# EAGLE design shield Arduino (EAGLE 6.1)
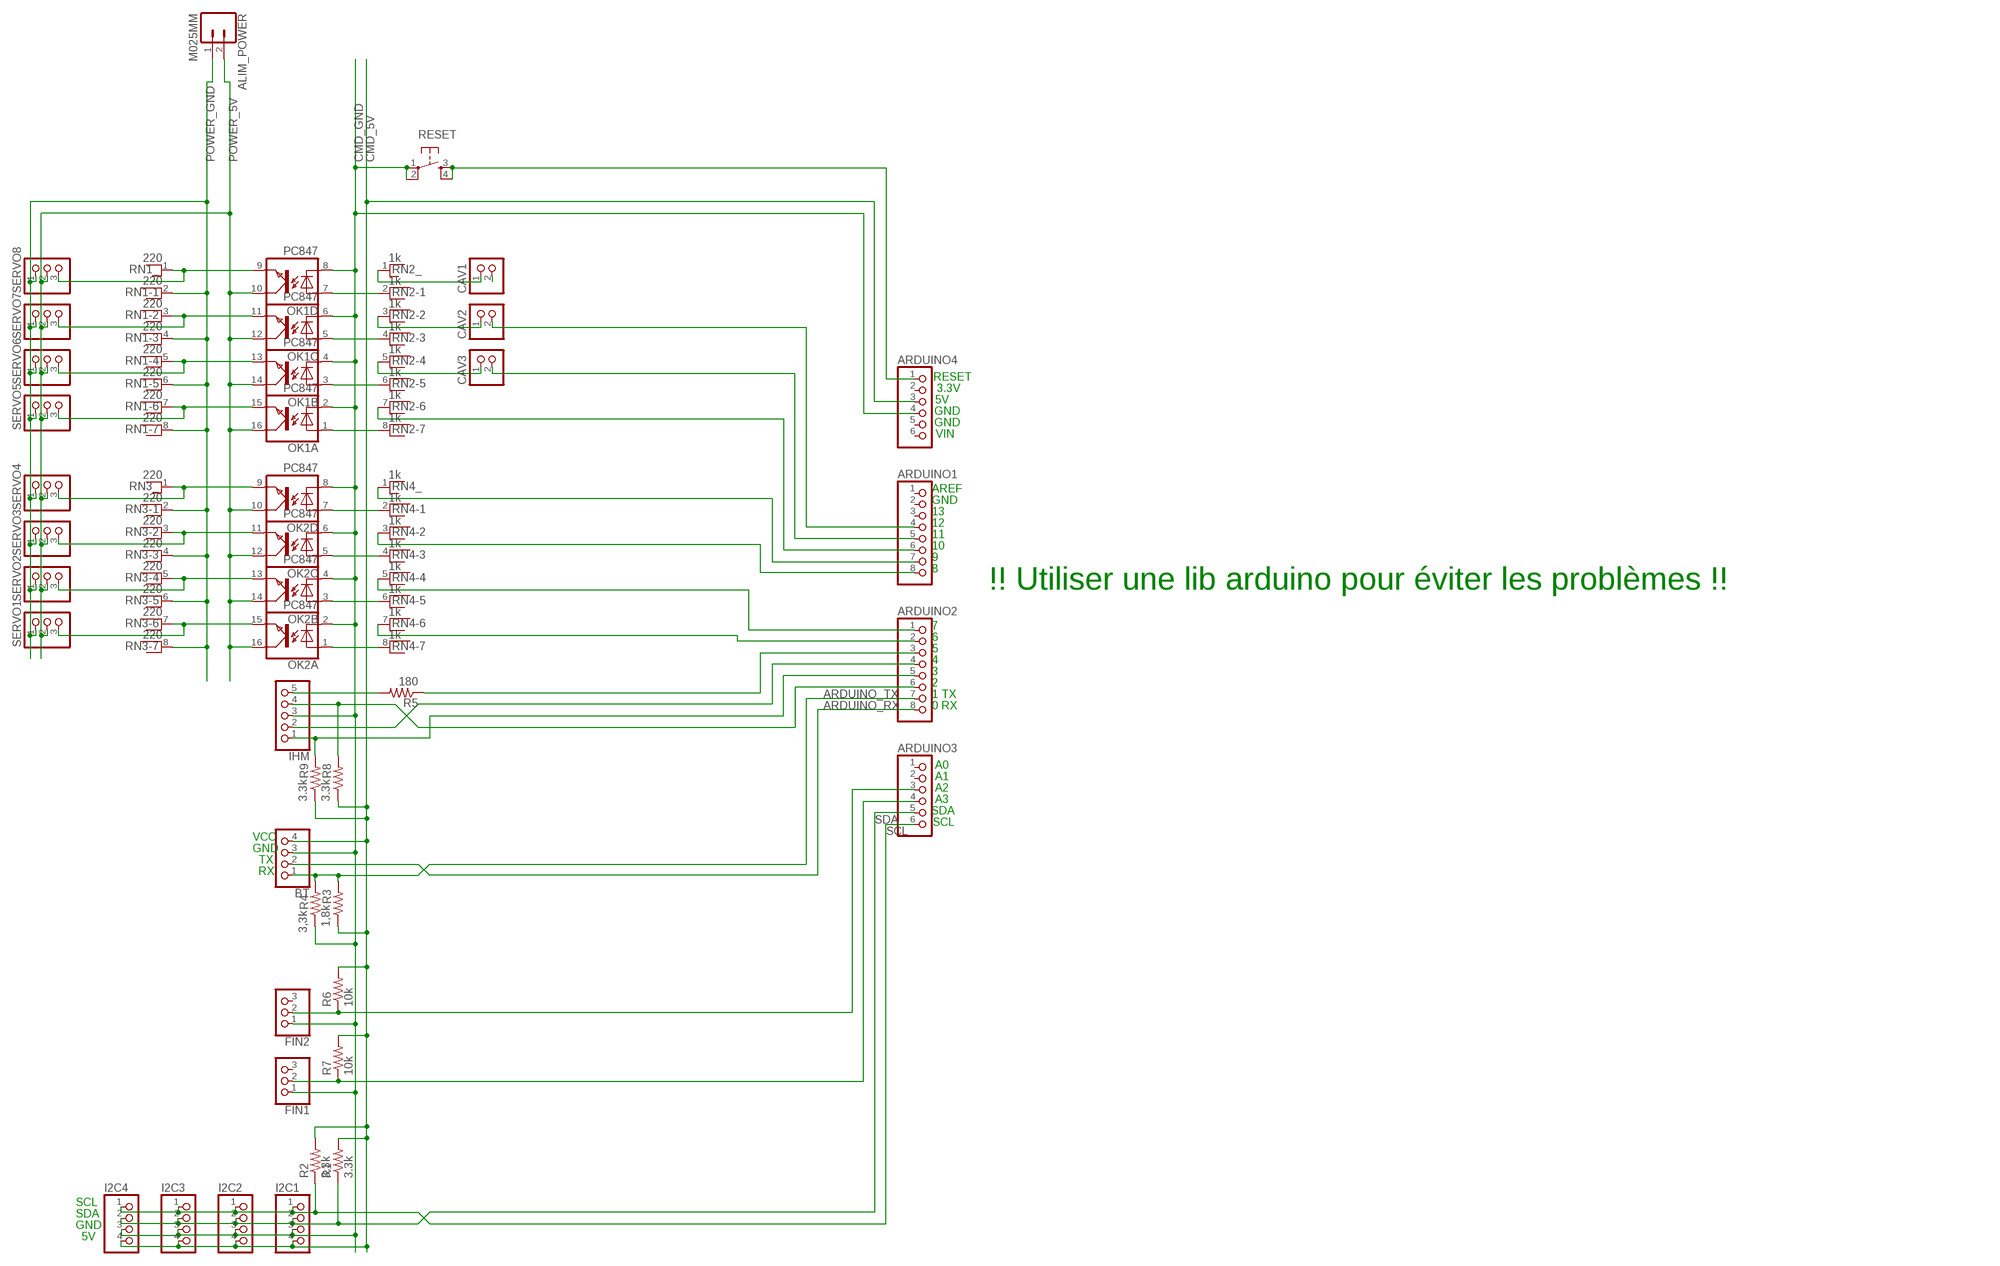
[diagram p0: schematic, sheet 1]

## Parts
ALIM_POWER  M025MM  [SCREWTERMINAL-5MM-2]
ARDUINO1  PINHD-1X8  [1X08]
ARDUINO2  PINHD-1X8  [1X08]
ARDUINO3  PINHD-1X6  [1X06]
ARDUINO4  PINHD-1X6  [1X06]
BT  PINHD-1X4  [1X04]
CAV1  PINHD-1X2  [1X02]
CAV2  PINHD-1X2  [1X02]
CAV3  PINHD-1X2  [1X02]
FIN1  PINHD-1X3  [1X03]
FIN2  PINHD-1X3  [1X03]
I2C1  PINHD-1X4  [1X04]
I2C2  PINHD-1X4  [1X04]
I2C3  PINHD-1X4  [1X04]
I2C4  PINHD-1X4  [1X04]
IHM  PINHD-1X5  [1X05]
OK1  PC847  [DIL16]
OK2  PC847  [DIL16]
R1  3.3k  R-US_0204/7  [0204/7]
R2  3.3k  R-US_0204/7  [0204/7]
R3  1,8k  R-US_0204/7  [0204/7]
R4  3,3k  R-US_0204/7  [0204/7]
R5  180  R-US_0204/7  [0204/7]
R6  10k  R-US_0204/7  [0204/7]
R7  10k  R-US_0204/7  [0204/7]
R8  3.3k  R-US_0204/7  [0204/7]
R9  3.3k  R-US_0204/7  [0204/7]
RESET  TAC_SWITCHPTH  [TACTILE-PTH]
RN1  220  RNX7  [RN-8]
RN2  1k  RNX7  [RN-8]
RN3  220  RNX7  [RN-8]
RN4  1k  RNX7  [RN-8]
SERVO1  PINHD-1X3  [1X03]
SERVO2  PINHD-1X3  [1X03]
SERVO3  PINHD-1X3  [1X03]
SERVO4  PINHD-1X3  [1X03]
SERVO5  PINHD-1X3  [1X03]
SERVO6  PINHD-1X3  [1X03]
SERVO7  PINHD-1X3  [1X03]
SERVO8  PINHD-1X3  [1X03]

## Nets
ARDUINO_RX: ARDUINO2.8 BT.2
ARDUINO_TX: ARDUINO2.7 BT.1 R3.2 R4.2
CMD_5V: ARDUINO4.3 BT.4 I2C1.4 I2C2.4 I2C3.4 I2C4.4 R1.2 R2.2 R3.1 R6.2 R7.2 R8.1 R9.1
CMD_GND: ARDUINO4.4 BT.3 FIN1.1 FIN2.1 I2C1.3 I2C2.3 I2C3.3 I2C4.3 IHM.3 OK1.2(A:C) OK1.4(B:C) OK1.6(C:C) OK1.8(D:C) OK2.2(A:C) OK2.4(B:C) OK2.6(C:C) OK2.8(D:C) R4.1 RESET.1 RESET.2
N$1: CAV1.2
N$2: OK2.7(D:A) RN4.2
N$3: ARDUINO1.4 CAV2.2
N$4: OK2.5(C:A) RN4.4
N$5: OK2.3(B:A) RN4.6
N$6: OK1.15(A:EMIT) RN1.7 SERVO5.3
N$7: OK1.9(D:EMIT) RN1.1 SERVO8.3
N$8: ARDUINO1.5 CAV3.2
N$9: OK2.1(A:A) RN4.8
N$10: OK1.11(C:EMIT) RN1.3 SERVO7.3
N$11: OK1.13(B:EMIT) RN1.5 SERVO6.3
N$12: OK1.1(A:A) RN2.8
N$13: OK1.3(B:A) RN2.6
N$14: OK1.5(C:A) RN2.4
N$15: OK1.7(D:A) RN2.2
N$16: CAV1.1 RN2.1
N$17: CAV2.1 RN2.3
N$18: CAV3.1 RN2.5
N$19: ARDUINO1.6 RN2.7
N$20: OK2.15(A:EMIT) RN3.7 SERVO1.3
N$21: OK2.9(D:EMIT) RN3.1 SERVO4.3
N$22: OK2.11(C:EMIT) RN3.3 SERVO3.3
N$23: OK2.13(B:EMIT) RN3.5 SERVO2.3
N$24: ARDUINO4.1 RESET.3 RESET.4
N$28: ARDUINO1.7 RN4.1
N$29: ARDUINO1.8 RN4.3
N$30: ARDUINO2.1 RN4.5
N$31: ARDUINO2.2 RN4.7
N$33: IHM.5 R5.2
N$34: ARDUINO3.4 FIN1.2 R7.1
N$35: ARDUINO3.3 FIN2.2 R6.1
N$36: ARDUINO2.3 R5.1
N$37: ARDUINO2.5 IHM.1 R9.2
N$38: ARDUINO2.4 IHM.2
N$39: ARDUINO2.6 IHM.4 R8.2
POWER_5V: ALIM_POWER.2 OK1.10(D:COL) OK1.12(C:COL) OK1.14(B:COL) OK1.16(A:COL) OK2.10(D:COL) OK2.12(C:COL) OK2.14(B:COL) OK2.16(A:COL) SERVO1.2 SERVO2.2 SERVO3.2 SERVO4.2 SERVO5.2 SERVO6.2 SERVO7.2 SERVO8.2
POWER_GND: ALIM_POWER.1 RN1.2 RN1.4 RN1.6 RN1.8 RN3.2 RN3.4 RN3.6 RN3.8 SERVO1.1 SERVO2.1 SERVO3.1 SERVO4.1 SERVO5.1 SERVO6.1 SERVO7.1 SERVO8.1
SCL: ARDUINO3.6 I2C1.1 I2C2.1 I2C3.1 I2C4.1 R2.1
SDA: ARDUINO3.5 I2C1.2 I2C2.2 I2C3.2 I2C4.2 R1.1
Unconnected: ARDUINO1.1 ARDUINO1.2 ARDUINO1.3 ARDUINO3.1 ARDUINO3.2 ARDUINO4.2 ARDUINO4.5 ARDUINO4.6 FIN1.3 FIN2.3

## Notes on the sheet
- RESET
- 3.3V
- 5V
- GND
- GND
- VIN
- AREF
- GND
- 13
- 12
- 11
- 10
- 9
- 8
- !! Utiliser une lib arduino pour éviter les problèmes !!
- 7
- 6
- 5
- 4
- 3
- 2
- 1 TX
- 0 RX
- A0
- A1
- A2
- A3
- SDA
- SCL
- VCC
- GND
- TX
- RX
- SCL
- SDA
- GND
- 5V

## Library data of the parts
ALIM_POWER = SparkFun-Connectors:M02: Standard 2-pin 0.1" header. Use with - straight break away headers ( PRT-00116) - right angle break away headers (PRT-00553) - swiss pins (PRT-00743) - machine pins (PRT-00117) - female headers (PRT-00115) Molex polarized connector foot print use with: PRT-08233 with associated crimp pins and housings. 2.54_SCREWTERM for use with PRT-10571. 3.5mm Screw Terminal footprints for PRT-08084 5mm Screw Terminal footprints for use with PRT-08433
ARDUINO1 ARDUINO2 = pinhead:PINHD-1X8: PIN HEADER
ARDUINO3 ARDUINO4 = pinhead:PINHD-1X6: PIN HEADER
BT I2C1-I2C4 = pinhead:PINHD-1X4: PIN HEADER
CAV1-CAV3 = pinhead:PINHD-1X2: PIN HEADER
FIN1 FIN2 SERVO1-SERVO8 = pinhead:PINHD-1X3: PIN HEADER
IHM = pinhead:PINHD-1X5: PIN HEADER
OK1 OK2 = optocoupler:PC847: SHARP OPTO COUPLER; OC_FARNELL: 9707735; OC_NEWARK: unknown
R1-R9 = resistor:R-US_: RESISTOR, American symbol
RESET = SparkFun-Electromechanical:TAC_SWITCH: Momentary Switch Button commonly used for reset or general input. Spark Fun Electronics SKU : COM-00097 SMT- SWCH-08247
RN1-RN4 = resistor-net:RNX7: RESISTOR NETWORK; OC_FARNELL: unknown; OC_NEWARK: unknown

## Board
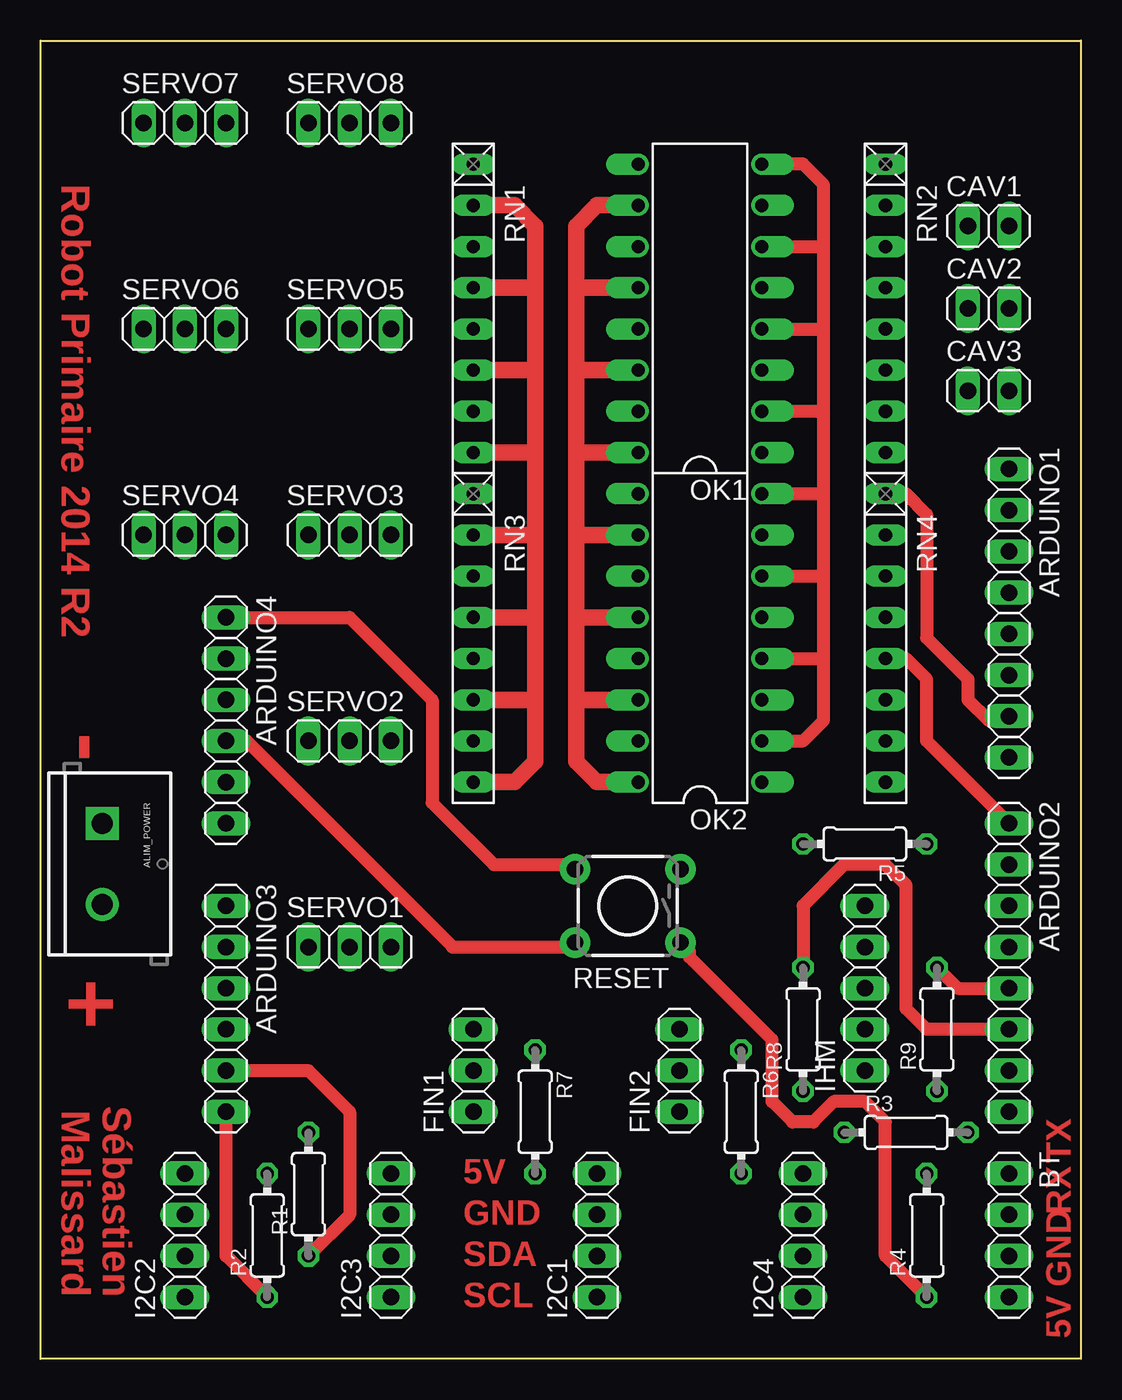
[diagram p1: board, top side]
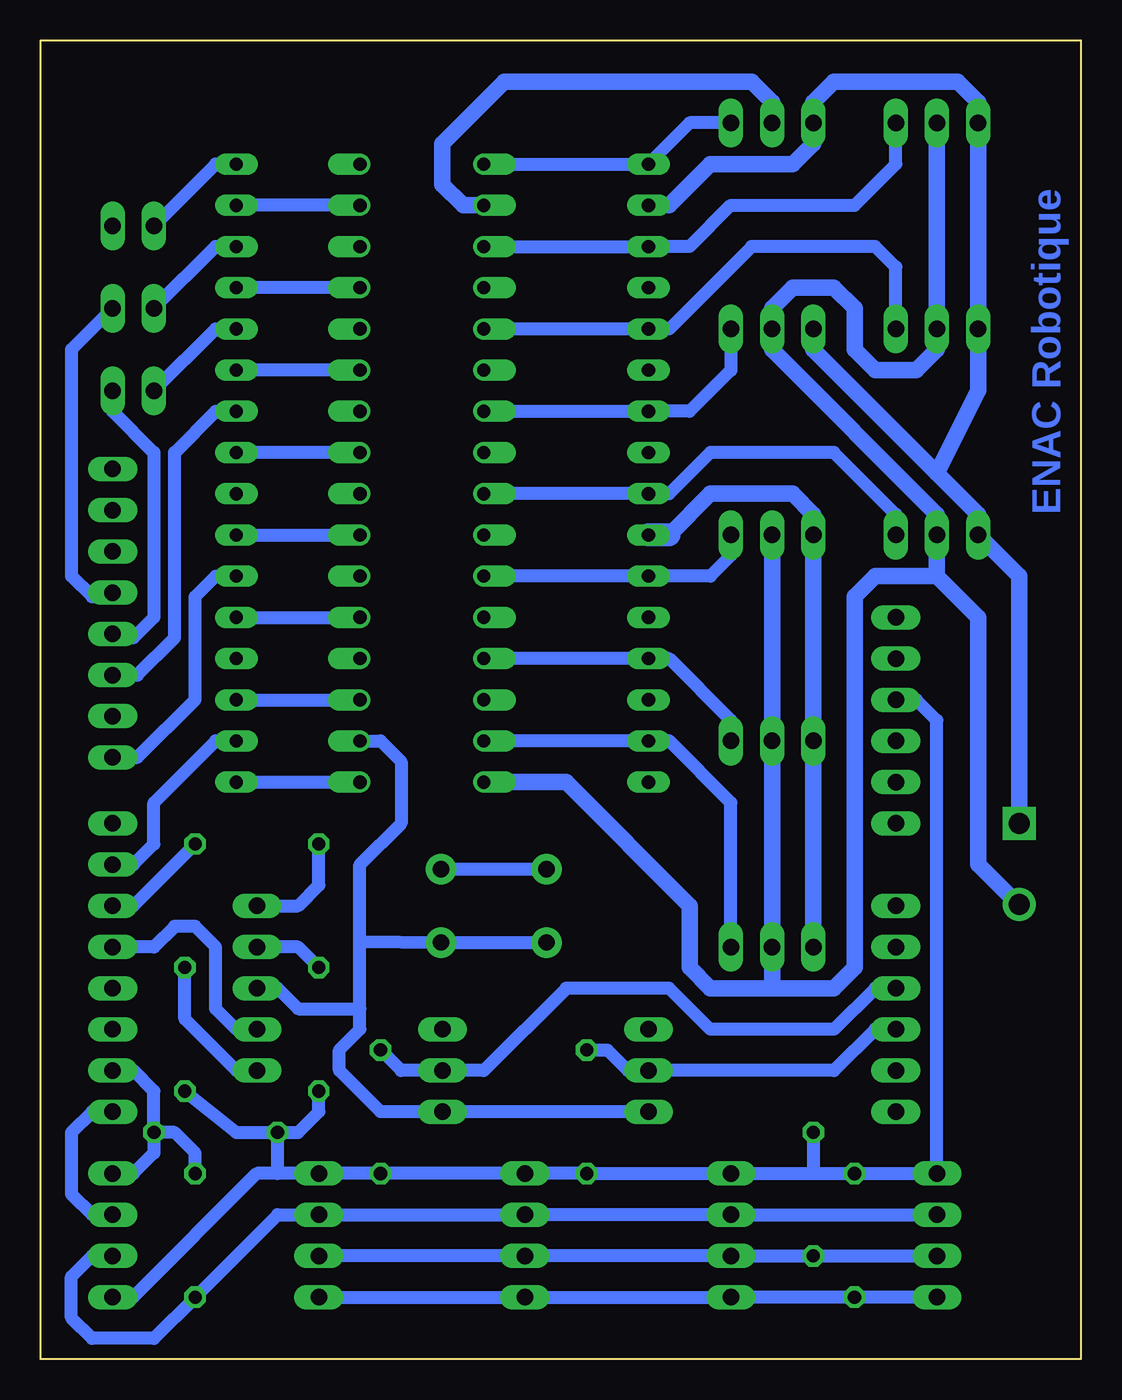
[diagram p2: board, bottom side, seen from below]

Size 64.14 x 81.28 mm. Coordinates in mm from the lower left corner, seen from the top.
Outline: 64.14,0 0,0 0,81.28 64.14,81.28 64.14,0
Copper layers (1*16): Top 0.035mm / dielectric 1.5mm / Bottom 0.035mm
Design rules: minimum track width 8mil, minimum drill 24mil, track to track 15mil, track to pad 15mil, pad to pad 15mil, via to via 15mil, smd to smd 8mil, copper to edge 20mil, drill to drill 8mil, minimum pad ring 10mil, minimum via ring 8mil, stop-mask expansion 4mil, vias tented up to drill 0mil, thermal gap 10mil

### Footprints (pad centres in the part's own frame; a part is rotated, then mirrored left to right if it is on the bottom)
SCREWTERMINAL-5MM-2 = drill 1.3 pad 2.032 square: 1 0,0 | drill 1.3 pad 2.032: 2 5,0
1X08 = drill 1.016 long: 1 -8.89,0; 2 -6.35,0; 3 -3.81,0; 4 -1.27,0; 5 1.27,0; 6 3.81,0; 7 6.35,0; 8 8.89,0
1X06 = drill 1.016 long: 1 -6.35,0; 2 -3.81,0; 3 -1.27,0; 4 1.27,0; 5 3.81,0; 6 6.35,0
1X04 = drill 1.016 long: 1 -3.81,0; 2 -1.27,0; 3 1.27,0; 4 3.81,0
1X02 = drill 1.016 long: 1 -1.27,0; 2 1.27,0
1X03 = drill 1.016 long: 1 -2.54,0; 2 0,0; 3 2.54,0
1X05 = drill 1.016 long: 1 -5.08,0; 2 -2.54,0; 3 0,0; 4 2.54,0; 5 5.08,0
DIL16 = drill 0.813 offset: 1 -8.89,-3.81; 2 -6.35,-3.81; 3 -3.81,-3.81; 4 -1.27,-3.81; 5 1.27,-3.81; 6 3.81,-3.81; 7 6.35,-3.81; 8 8.89,-3.81; 9 8.89,3.81; 10 6.35,3.81; 11 3.81,3.81; 12 1.27,3.81; 13 -1.27,3.81; 14 -3.81,3.81; 15 -6.35,3.81; 16 -8.89,3.81
0204/7 = drill 0.813 octagon: 1 -3.81,0; 2 3.81,0
TACTILE-PTH = drill 1.016 pad 1.88: 1 -3.251,2.261; 2 3.251,2.261; 3 -3.251,-2.261; 4 3.251,-2.261
RN-8 = drill 0.813 long: 1 -8.89,0; 2 -6.35,0; 3 -3.81,0; 4 -1.27,0; 5 1.27,0; 6 3.81,0; 7 6.35,0; 8 8.89,0

### Placement (x,y rotation side)
ALIM_POWER  3.81,33.02 270 top
ARDUINO1  59.69,45.97 270 top
ARDUINO2  59.69,24.13 270 top
ARDUINO3  11.43,21.59 270 top
ARDUINO4  11.43,39.37 270 top
BT  59.69,7.62 270 top
CAV1  58.42,69.85 0 top
CAV2  58.42,64.77 0 top
CAV3  58.42,59.69 0 top
FIN1  26.67,17.78 90 top
FIN2  39.37,17.78 90 top
I2C1  34.29,7.62 90 top
I2C2  8.89,7.62 90 top
I2C3  21.59,7.62 90 top
I2C4  46.99,7.62 90 top
IHM  50.8,22.86 90 top
OK1  40.64,64.77 90 top
OK2  40.64,44.45 90 top
R1  16.51,10.16 90 top
R2  13.97,7.62 90 top
R3  53.34,13.97 0 top
R4  54.61,7.62 90 top
R5  50.8,31.75 180 top
R6  43.18,15.24 270 top
R7  30.48,15.24 270 top
R8  46.99,20.32 90 top
R9  55.24,20.32 90 top
RESET  36.2,27.94 180 top
RN1  26.67,64.77 270 top
RN2  52.07,64.77 270 top
RN3  26.67,44.45 270 top
RN4  52.07,44.45 270 top
SERVO1  19.05,25.4 0 top
SERVO2  19.05,38.1 0 top
SERVO3  19.05,50.8 0 top
SERVO4  8.89,50.8 0 top
SERVO5  19.05,63.5 0 top
SERVO6  8.89,63.5 0 top
SERVO7  8.89,76.2 0 top
SERVO8  19.05,76.2 0 top

### Tracks (layer width: path | path; a pad name or v marks a point on that pad's centre or on a via)
ARDUINO_RX
  Bottom 0.813: ARDUINO2.8 60.96,15.24 62.23,13.97 62.23,10.16 60.96,8.89 BT.2
ARDUINO_TX
  Bottom 0.813: R4.2 54.61,12.7 55.88,13.97 R3.2 | R3.2 57.15,16.51 58.42,17.78 ARDUINO2.7 | R3.2 57.15,12.7 58.42,11.43 BT.1
CMD_5V
  Bottom 0.813: 16.51,11.43 I2C3.4 R7.2 I2C1.4 R6.2 I2C4.4 49.53,11.43 | 16.51,11.43 R2.2 I2C2.4 8.89,39.37 10.16,40.64 ARDUINO4.3 | R1.2 16.51,11.43 | 49.53,11.43 R3.1 | BT.4 58.42,3.81 50.8,11.43 49.53,11.43 | R9.1 52.07,13.97 R3.1 | R3.1 48.26,13.97 46.99,15.24 R8.1
CMD_GND
  Top 0.813: OK2.2 46.99,38.1 48.26,39.37 48.26,43.18 | 48.26,43.18 48.26,48.26 | 48.26,48.26 48.26,53.34 | 48.26,53.34 48.26,58.42 | 48.26,58.42 48.26,63.5 | 48.26,63.5 48.26,68.58 | 48.26,68.58 48.26,72.39 46.99,73.66 OK1.8 | OK1.6 48.26,68.58 | OK1.4 48.26,63.5 | OK1.2 48.26,58.42 | OK2.8 48.26,53.34 | OK2.6 48.26,48.26 | OK2.4 48.26,43.18 | ARDUINO4.4 12.7,38.1 25.4,25.4 32.66,25.4 RESET.2 | R4.1 52.07,6.35 52.07,14.61 50.8,15.88 48.9,15.88 47.62,14.61 46.35,14.61 45.09,15.88 45.09,19.68 40,24.77 40,25.12 RESET.1
  Bottom 0.813: I2C4.3 I2C1.3 | 33.02,8.89 I2C1.3 | I2C1.3 I2C3.3 I2C2.3 | I2C4.3 48.26,8.89 | BT.3 60.96,6.35 62.23,5.08 62.23,2.54 60.96,1.27 57.15,1.27 R4.1 49.53,8.89 I2C4.3 | FIN1.1 FIN2.1 43.18,15.24 45.72,17.78 45.72,19.05 44.45,20.32 44.45,21.59 | 44.45,25.76 RESET.1 RESET.2 | 44.45,25.76 44.45,30.48 41.91,33.02 41.91,36.83 43.18,38.1 OK2.2 | 44.45,21.59 44.45,25.76 | IHM.3 49.53,22.86 48.26,21.59 44.45,21.59
N$2
  Bottom 0.813: RN4.2 OK2.7
N$3
  Bottom 0.813: CAV2.2 62.23,62.23 62.23,48.26 60.96,46.99 59.94,46.99 ARDUINO1.4
N$4
  Bottom 0.813: RN4.4 OK2.5
N$5
  Bottom 0.813: RN4.6 OK2.3
N$6
  Bottom 0.813: OK1.15 RN1.7 24.13,58.42 21.59,60.96 SERVO5.3
N$7
  Bottom 0.813: OK1.9 RN1.1 24.13,76.2 SERVO8.3
N$8
  Bottom 0.813: CAV3.2 59.69,58.42 57.15,55.88 57.15,45.72 58.42,44.45 59.44,44.45 ARDUINO1.5
N$9
  Bottom 0.813: RN4.8 OK2.1
N$10
  Bottom 0.813: OK1.11 RN1.3 24.13,68.58 21.59,71.12 13.97,71.12 11.43,73.66 SERVO7.3
N$11
  Bottom 0.813: OK1.13 RN1.5 25.4,63.5 20.32,68.58 12.7,68.58 11.43,67.31 SERVO6.3
N$12
  Bottom 0.813: OK1.1 RN2.8
N$13
  Bottom 0.813: OK1.3 RN2.6
N$14
  Bottom 0.813: OK1.5 RN2.4
N$15
  Bottom 0.813: OK1.7 RN2.2
N$16
  Bottom 0.813: CAV1.1 53.34,73.66 RN2.1
N$17
  Bottom 0.813: CAV2.1 53.34,68.58 RN2.3
N$18
  Bottom 0.813: CAV3.1 53.34,63.5 RN2.5
N$19
  Bottom 0.813: ARDUINO1.6 58.17,42.16 55.88,44.45 55.88,55.88 53.34,58.42 RN2.7
N$20
  Bottom 0.813: OK2.15 RN3.7 25.4,38.1 21.59,34.29 SERVO1.3
N$21
  Bottom 0.813: OK2.9 RN3.1 25.4,53.34 22.86,55.88 15.24,55.88 11.43,52.07 SERVO4.3
N$22
  Bottom 0.813: OK2.11 RN3.3 22.86,48.26 21.59,49.53 SERVO3.3
N$23
  Bottom 0.813: OK2.13 RN3.5 25.4,43.18 21.59,39.37 SERVO2.3
N$24
  Top 0.813: ARDUINO4.1 19.05,45.72 24.13,40.64 24.13,34.29 27.94,30.48 32.66,30.48 RESET.4
  Bottom 0.813: RESET.3 RESET.4
N$28
  Top 0.813: RN4.1 53.34,53.34 54.61,52.07 54.61,44.45 57.15,41.91 57.15,40.64 58.42,39.37 59.44,39.37 ARDUINO1.7
N$29
  Bottom 0.813: ARDUINO1.8 58.17,37.08 54.61,40.64 54.61,46.99 53.34,48.26 RN4.3
N$30
  Top 0.813: ARDUINO2.1 54.61,38.1 54.61,41.91 53.34,43.18 RN4.5
N$31
  Bottom 0.813: ARDUINO2.2 58.42,30.48 57.15,31.75 57.15,34.29 53.34,38.1 RN4.7
N$33
  Bottom 0.813: IHM.5 48.26,27.94 46.99,29.21 R5.2
N$34
  Bottom 0.813: R7.1 29.21,19.05 27.94,17.78 FIN1.2 15.24,17.78 12.7,20.32 ARDUINO3.4
N$35
  Bottom 0.813: ARDUINO3.3 12.7,22.86 15.24,20.32 22.86,20.32 25.4,22.86 31.75,22.86 36.83,17.78 FIN2.2 41.91,17.78 R6.1
N$36
  Bottom 0.813: ARDUINO2.3 58.42,27.94 R5.1
N$37
  Top 0.813: R9.2 56.51,22.86 ARDUINO2.5
  Bottom 0.813: IHM.1 52.07,17.78 55.24,20.96 R9.2
N$38
  Bottom 0.813: IHM.2 52.07,20.32 53.34,21.59 53.34,25.4 54.61,26.67 55.88,26.67 57.15,25.4 ARDUINO2.4
N$39
  Top 0.813: ARDUINO2.6 54.61,20.32 53.34,21.59 53.34,29.21 52.07,30.48 49.53,30.48 46.99,27.94 R8.2
  Bottom 0.813: R8.2 48.26,25.4 IHM.4
POWER_5V
  Top 1.016: OK2.16 34.29,35.56 33.02,36.83 33.02,40.64 | 33.02,40.64 33.02,45.72 | 33.02,45.72 33.02,50.8 | 33.02,50.8 33.02,55.88 | 33.02,55.88 33.02,60.96 | 33.02,60.96 33.02,66.04 | 33.02,66.04 33.02,69.85 34.29,71.12 OK1.10 | OK1.12 33.02,66.04 | OK1.14 33.02,60.96 | OK1.16 33.02,55.88 | OK2.10 33.02,50.8 | OK2.12 33.02,45.72 | OK2.14 33.02,40.64
  Bottom 1.016: SERVO3.2 SERVO2.2 SERVO1.2 19.05,22.86 | 8.89,48.26 SERVO4.2 8.89,52.07 19.05,62.23 SERVO5.2 19.05,64.77 17.78,66.04 15.24,66.04 13.97,64.77 13.97,62.23 12.7,60.96 10.16,60.96 8.89,62.23 SERVO6.2 SERVO7.2 | 8.89,48.26 12.7,48.26 13.97,46.99 13.97,24.13 15.24,22.86 19.05,22.86 | 19.05,22.86 22.86,22.86 24.13,24.13 24.13,27.94 31.75,35.56 OK2.16 | 3.89,28.02 6.35,30.48 6.35,45.72 8.89,48.26 | OK1.10 38.1,71.12 39.37,72.39 39.37,74.93 35.56,78.74 20.32,78.74 19.05,77.47 SERVO8.2
  Bottom 1.422: ALIM_POWER.2 3.89,28.02
POWER_GND
  Top 1.016: RN3.8 29.21,35.56 30.48,36.83 30.48,40.64 | 30.48,40.64 30.48,45.72 | 30.48,45.72 30.48,50.8 | 30.48,50.8 30.48,55.88 | 30.48,55.88 30.48,60.96 | 30.48,60.96 30.48,66.04 | 30.48,66.04 30.48,69.85 29.21,71.12 RN1.2 | RN1.4 30.48,66.04 | RN1.6 30.48,60.96 | RN1.8 30.48,55.88 | RN3.2 30.48,50.8 | RN3.4 30.48,45.72 | RN3.6 30.48,40.64
  Bottom 1.016: SERVO1.1 SERVO2.1 SERVO3.1 16.51,52.07 17.78,53.34 22.86,53.34 25.4,50.8 | RN1.2 25.4,71.12 22.86,73.66 17.78,73.66 16.51,74.93 SERVO8.1 16.51,77.47 15.24,78.74 7.62,78.74 6.35,77.47 SERVO7.1 SERVO6.1 6.35,59.69 8.89,54.61 | ALIM_POWER.1 3.81,48.26 SERVO4.1 6.35,52.07 8.89,54.61 | 8.89,54.61 16.51,62.23 SERVO5.1
  Bottom 1.422: 25.4,50.8 RN3.2
SCL
  Top 0.813: R2.1 11.43,6.35 ARDUINO3.6
  Bottom 0.813: I2C4.1 I2C1.1 I2C3.1 R2.1 I2C2.1
SDA
  Top 0.813: ARDUINO3.5 16.51,17.78 19.05,15.24 19.05,8.89 R1.1
  Bottom 0.813: I2C4.2 I2C1.2 I2C3.2 R1.1 I2C2.2

### Text on the board
Top: Robot Primaire 2014 R2 | - | + | TX | 5V | GND | RX | SDA | GND | Malissard | Sébastien | SCL | 5V
Bottom: ENAC Robotique